# EAGLE design finalmouse (EAGLE 9.6.2)
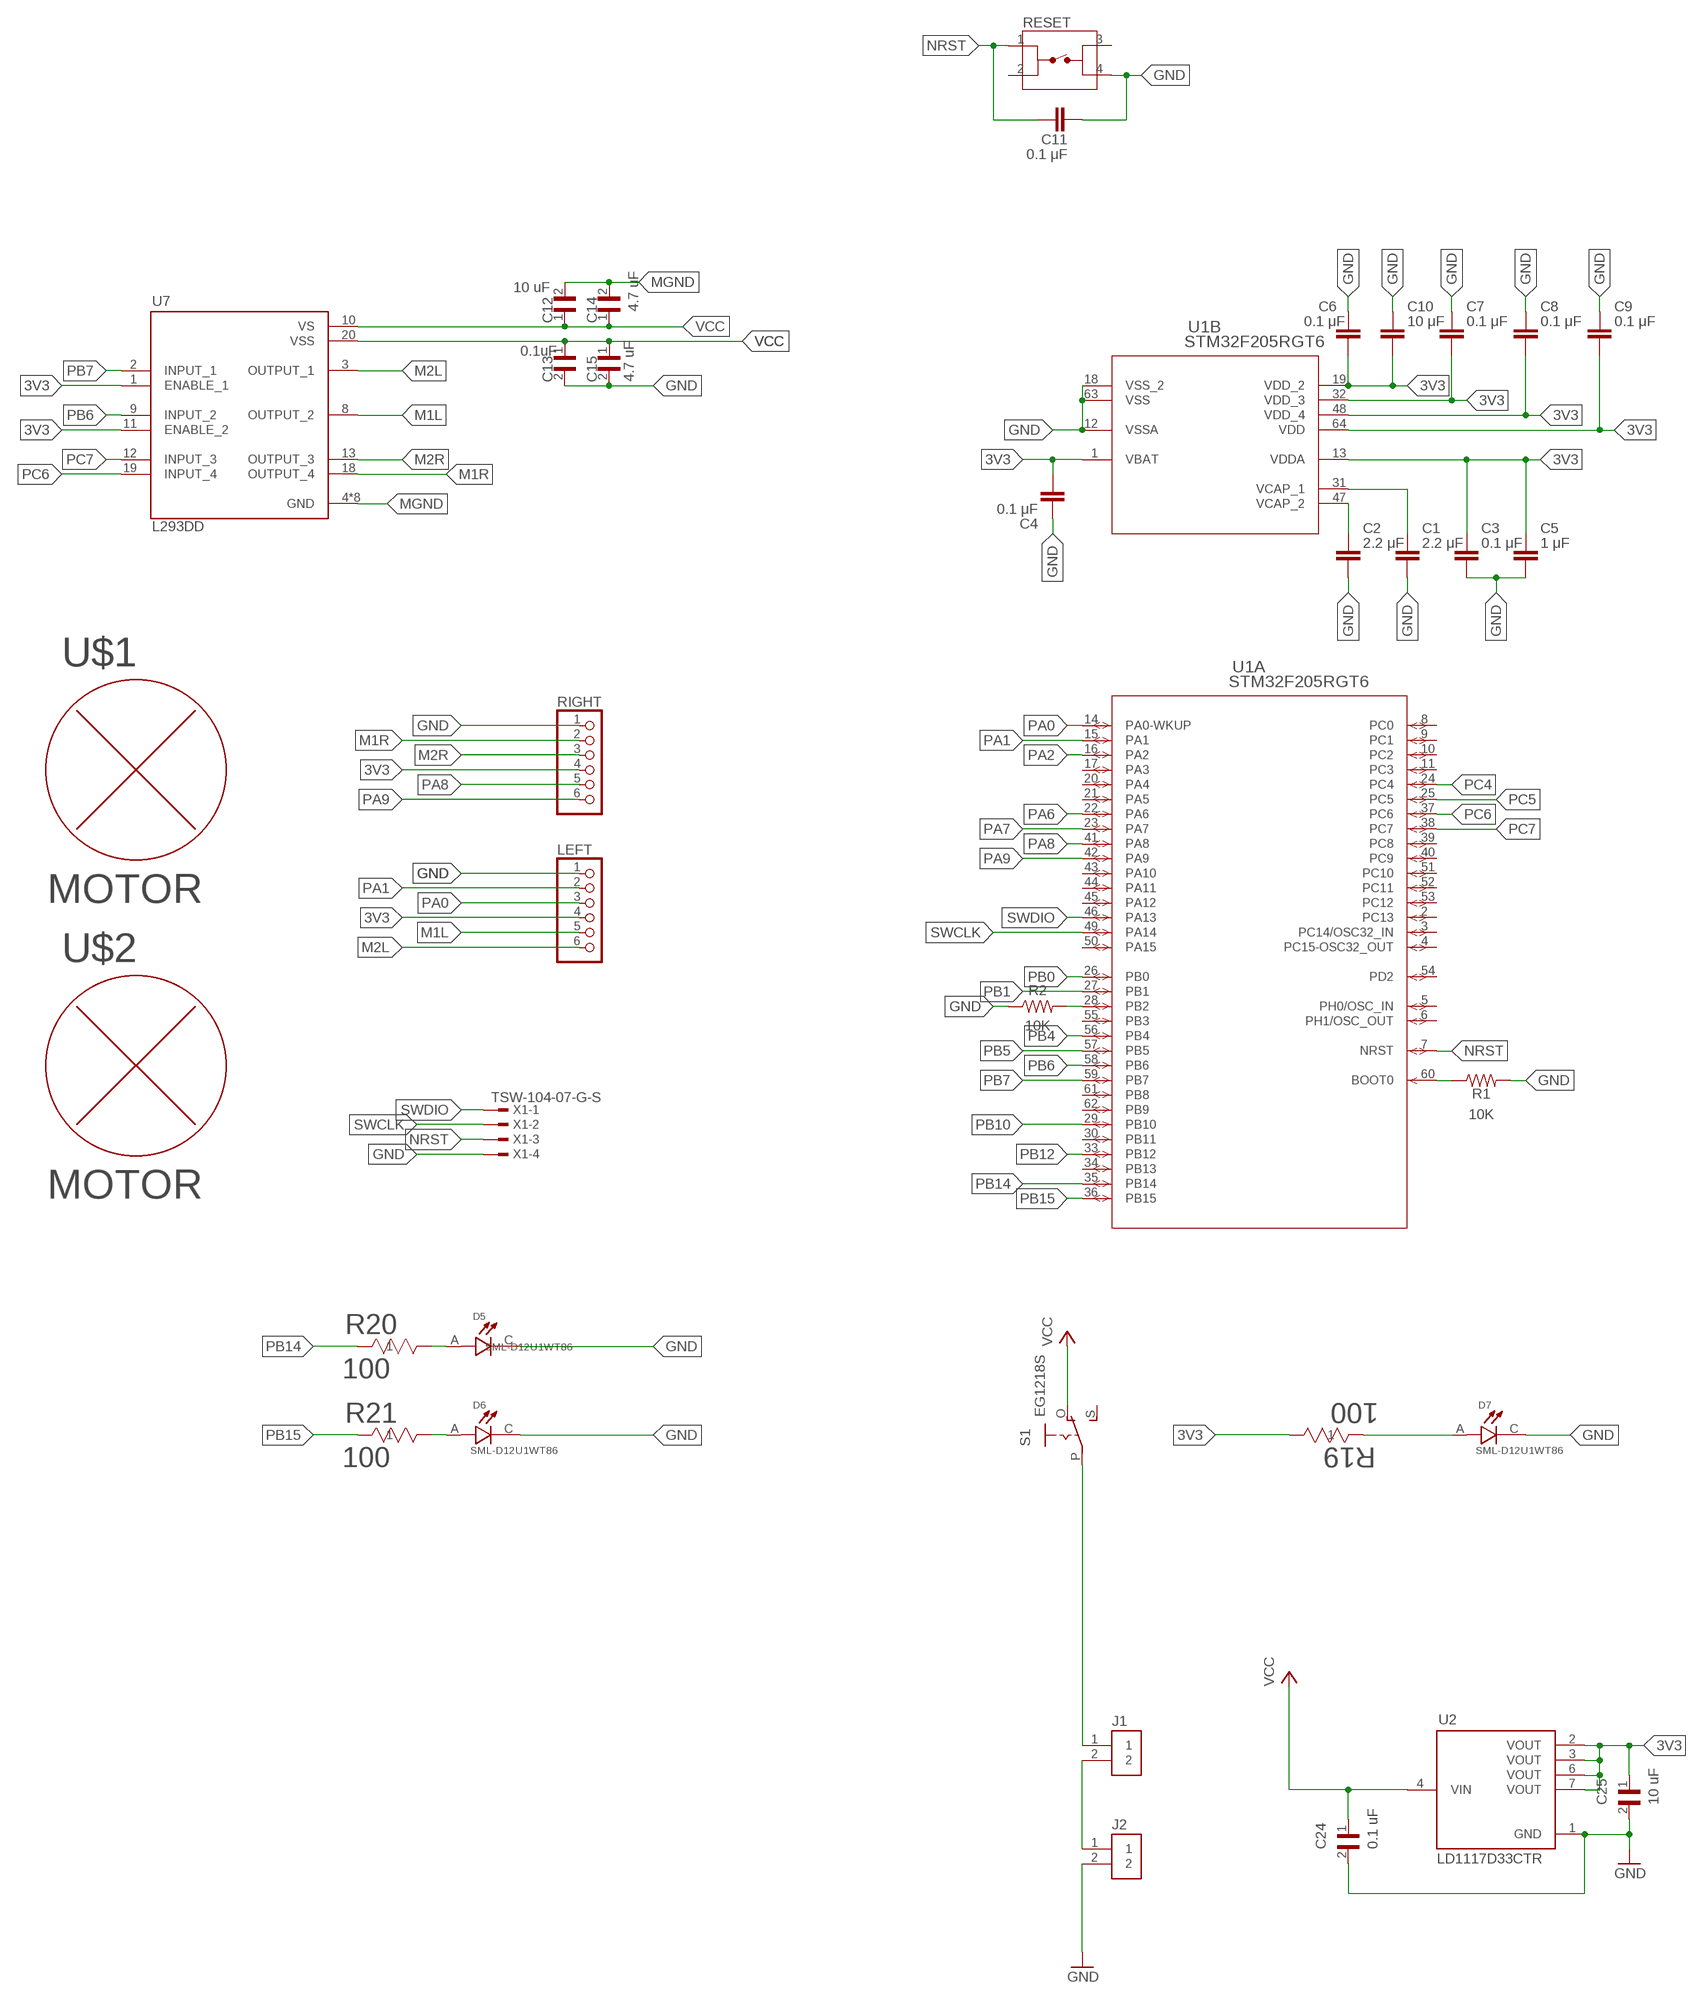
[diagram p0: schematic, sheet 1, part 1 of 2]
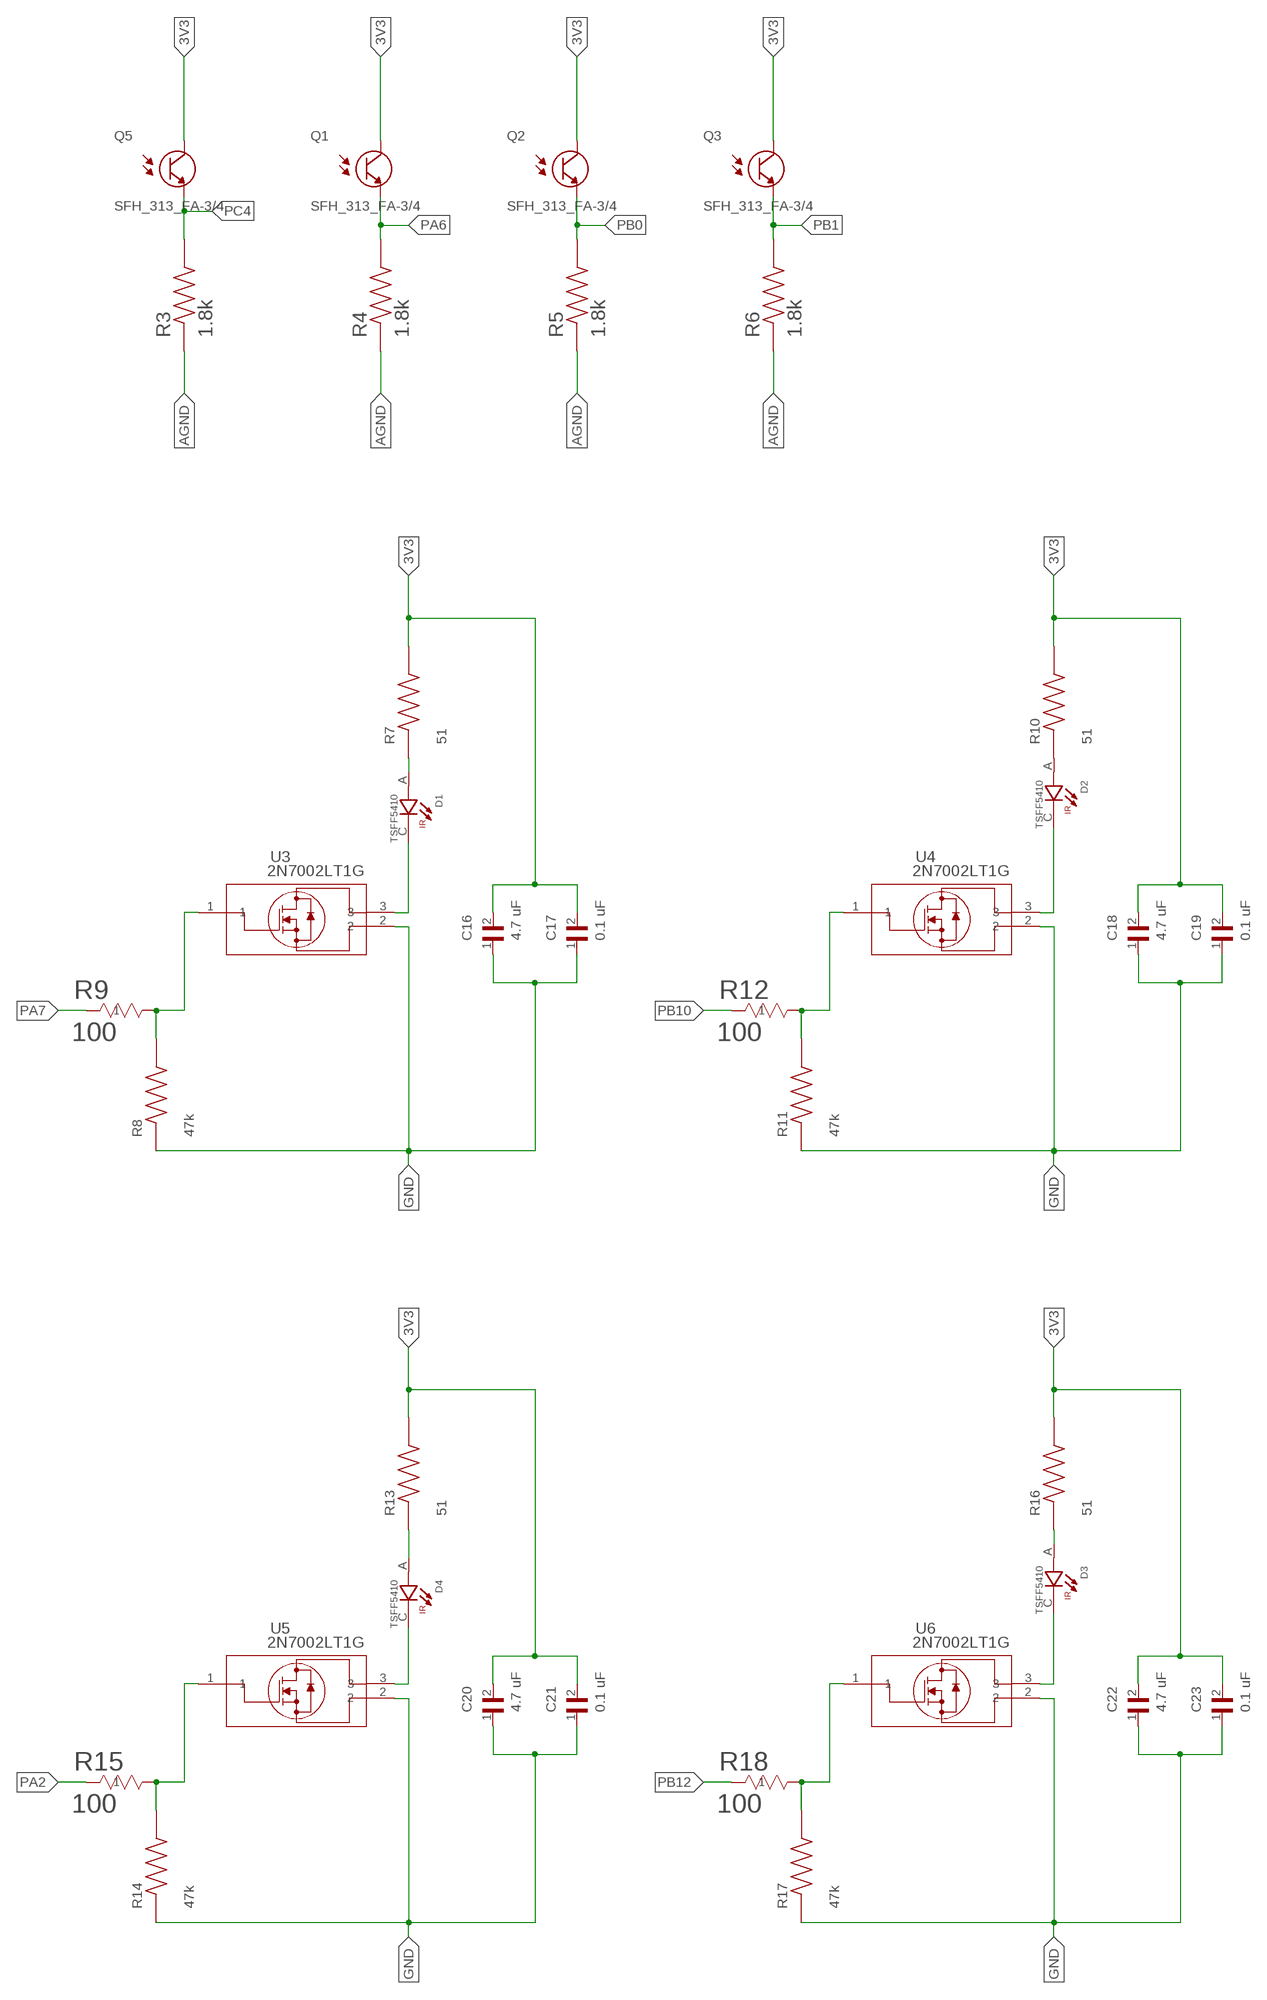
[diagram p1: schematic, sheet 1, part 2 of 2]

## Parts
C1  2.2 μF  C_CHIP-0603(1608-METRIC)  [CAPC1608X85]
C2  2.2 μF  C_CHIP-0603(1608-METRIC)  [CAPC1608X85]
C3  0.1 μF  C_CHIP-0603(1608-METRIC)  [CAPC1608X85]
C4  0.1 μF  C_CHIP-0603(1608-METRIC)  [CAPC1608X85]
C5  1 μF  C_CHIP-0603(1608-METRIC)  [CAPC1608X85]
C6  0.1 μF  C_CHIP-0603(1608-METRIC)  [CAPC1608X85]
C7  0.1 μF  C_CHIP-0603(1608-METRIC)  [CAPC1608X85]
C8  0.1 μF  C_CHIP-0603(1608-METRIC)  [CAPC1608X85]
C9  0.1 μF  C_CHIP-0603(1608-METRIC)  [CAPC1608X85]
C10  10 μF  C_CHIP-0603(1608-METRIC)  [CAPC1608X85]
C11  0.1 μF  C_CHIP-0603(1608-METRIC)  [CAPC1608X85]
C12  10 uF  CL21A106KPFNNNG  [CAPC2012X135N]
C13  0.1uF  08055C104K4T2A  [CAPC2012X94N]
C14  4.7 uF  C2012JB1C475K125AC  [CAPC2012X145N]
C15  4.7 uF  C2012JB1C475K125AC  [CAPC2012X145N]
C16  4.7 uF  C2012JB1C475K125AC  [CAPC2012X145N]
C17  0.1 uF  08055C104K4T2A  [CAPC2012X94N]
C18  4.7 uF  C2012JB1C475K125AC  [CAPC2012X145N]
C19  0.1 uF  08055C104K4T2A  [CAPC2012X94N]
C20  4.7 uF  C2012JB1C475K125AC  [CAPC2012X145N]
C21  0.1 uF  08055C104K4T2A  [CAPC2012X94N]
C22  4.7 uF  C2012JB1C475K125AC  [CAPC2012X145N]
C23  0.1 uF  08055C104K4T2A  [CAPC2012X94N]
C24  0.1 uF  CL21A106KPFNNNG  [CAPC2012X135N]
C25  10 uF  CL21A226MOQNNNE  [CAPC2012X135N]
D1  TSFF5410  [LEDRD254W55D595H1160]
D2  TSFF5410  [LEDRD254W55D595H1160]
D3  TSFF5410  [LEDRD254W55D595H1160]
D4  TSFF5410  [LEDRD254W55D595H1160]
D5  SML-D12U1WT86  [LED_SML-D12Y1WT86]
D6  SML-D12U1WT86  [LED_SML-D12Y1WT86]
D7  SML-D12U1WT86  [LED_SML-D12Y1WT86]
J1  B2B-PH-K-S(LF)(SN)  [JST_B2B-PH-K-S(LF)(SN)]
J2  B2B-PH-K-S(LF)(SN)  [JST_B2B-PH-K-S(LF)(SN)]
LEFT  PINHD-1X6  [1X06]
Q1  SFH_313_FA-3/4  [XDCR_SFH_313_FA-3/4]
Q2  SFH_313_FA-3/4  [XDCR_SFH_313_FA-3/4]
Q3  SFH_313_FA-3/4  [XDCR_SFH_313_FA-3/4]
Q5  SFH_313_FA-3/4  [XDCR_SFH_313_FA-3/4]
R1  10K  R-US_CHIP-0603(1608-METRIC)  [RESC1608X60]
R2  10K  R-US_CHIP-0603(1608-METRIC)  [RESC1608X60]
R3  1.8k  ESR10EZPJ182  [RESC2012X65N]
R4  1.8k  ESR10EZPJ182  [RESC2012X65N]
R5  1.8k  ESR10EZPJ182  [RESC2012X65N]
R6  1.8k  ESR10EZPJ182  [RESC2012X65N]
R7  51  ERJP06J510V  [RES_ERJP06J510V]
R8  47k  ERA6ARB473V  [RES_ERA6ARB473V]
R9  100  RK73G2ATTD1000D  [RES_RK73G2A_KOA]
R10  51  ERJP06J510V  [RES_ERJP06J510V]
R11  47k  ERA6ARB473V  [RES_ERA6ARB473V]
R12  100  RK73G2ATTD1000D  [RES_RK73G2A_KOA]
R13  51  ERJP06J510V  [RES_ERJP06J510V]
R14  47k  ERA6ARB473V  [RES_ERA6ARB473V]
R15  100  RK73G2ATTD1000D  [RES_RK73G2A_KOA]
R16  51  ERJP06J510V  [RES_ERJP06J510V]
R17  47k  ERA6ARB473V  [RES_ERA6ARB473V]
R18  100  RK73G2ATTD1000D  [RES_RK73G2A_KOA]
R19  100  RK73G2ATTD1000D  [RES_RK73G2A_KOA]
R20  100  RK73G2ATTD1000D  [RES_RK73G2A_KOA]
R21  100  RK73G2ATTD1000D  [RES_RK73G2A_KOA]
RESET  FSM4JSMA  [TE_FSM4JSMA]
RIGHT  PINHD-1X6  [1X06]
S1  EG1218S  [EG1218]
U1  STM32F205RGT6  [LQFP64-10X10MM]
U2  LD1117D33CTR  [SOIC127P600X175-8N]
U3  2N7002LT1G  [SOT-23_3L_ONS]
U4  2N7002LT1G  [SOT-23_3L_ONS]
U5  2N7002LT1G  [SOT-23_3L_ONS]
U6  2N7002LT1G  [SOT-23_3L_ONS]
U7  L293DD  [SOIC127P1032X265-20N]
U$1  MOTOR  [MOTOR]
U$2  MOTOR  [MOTOR]
X1  TSW-104-07-G-S  [TSW-104-XX-G-S]

## Nets
3V3: C3.1 C4.2 C5.1 C6.2 C7.2 C8.2 C9.2 C10.2 C16.2 C17.2 C18.2 C19.2 C20.2 C21.2 C22.2 C23.2 C25.1 LEFT.4 Q1.2(C) Q2.2(C) Q3.2(C) Q5.2(C) R7.2 R10.2 R13.2 R16.2 R19.2 RIGHT.4 U1.1(B:VBAT) U1.13(B:VDDA) U1.19(B:VDD_2) U1.32(B:VDD_3) U1.48(B:VDD_4) U1.64(B:VDD) U2.2(VOUT) U2.3(VOUT) U2.6(VOUT) U2.7(VOUT) U7.1(ENABLE_1) U7.11(ENABLE_2)
AGND: R3.1 R4.1 R5.1 R6.1
GND: C1.2 C2.2 C3.2 C4.1 C5.2 C6.1 C7.1 C8.1 C9.1 C10.1 C11.2 C13.2 C15.2 C16.1 C17.1 C18.1 C19.1 C20.1 C21.1 C22.1 C23.1 C24.2 C25.2 D5.C D6.C D7.C J2.2 LEFT.1 R1.2 R2.1 R8.1 R11.1 R14.1 R17.1 RESET.4 RIGHT.1 U1.12(B:VSSA) U1.18(B:VSS_2) U1.63(B:VSS) U2.1(GND) U3.2 U4.2 U5.2 U6.2 X1.4
M1L: LEFT.5 U7.8(OUTPUT_2)
M1R: RIGHT.2 U7.18(OUTPUT_4)
M2L: LEFT.6 U7.3(OUTPUT_1)
M2R: RIGHT.3 U7.13(OUTPUT_3)
MGND: C12.2 C14.2 U7.4(GND) U7.5(GND) U7.6(GND) U7.7(GND) U7.14(GND) U7.15(GND) U7.16(GND) U7.17(GND)
N$1: C1.1 U1.31(B:VCAP_1)
N$2: C2.1 U1.47(B:VCAP_2)
N$3: R1.1 U1.60(A:BOOT0)
N$4: R2.2 U1.28(A:PB2)
N$5: J1.1 S1.P
N$6: D1.A R7.1
N$7: R8.2 R9.2 U3.1
N$8: D1.C U3.3
N$9: D2.A R10.1
N$10: R11.2 R12.2 U4.1
N$11: D2.C U4.3
N$12: D3.A R16.1
N$13: R14.2 R15.2 U5.1
N$14: D4.C U5.3
N$15: D4.A R13.1
N$16: R17.2 R18.2 U6.1
N$17: D3.C U6.3
N$18: D7.A R19.1
N$19: J1.2 J2.1
N$21: D5.A R20.2
N$23: D6.A R21.2
NRST: C11.1 RESET.1 U1.7(A:NRST) X1.3
PA0: LEFT.3 U1.14(A:PA0-WKUP)
PA1: LEFT.2 U1.15(A:PA1)
PA2: R15.1 U1.16(A:PA2)
PA6: Q1.1(E) R4.2 U1.22(A:PA6)
PA7: R9.1 U1.23(A:PA7)
PA8: RIGHT.5 U1.41(A:PA8)
PA9: RIGHT.6 U1.42(A:PA9)
PB0: Q2.1(E) R5.2 U1.26(A:PB0)
PB1: Q3.1(E) R6.2 U1.27(A:PB1)
PB4: U1.56(A:PB4)
PB5: U1.57(A:PB5)
PB6: U1.58(A:PB6) U7.9(INPUT_2)
PB7: U1.59(A:PB7) U7.2(INPUT_1)
PB10: R12.1 U1.29(A:PB10)
PB12: R18.1 U1.33(A:PB12)
PB14: R20.1 U1.35(A:PB14)
PB15: R21.1 U1.36(A:PB15)
PC4: Q5.1(E) R3.2 U1.24(A:PC4)
PC5: U1.25(A:PC5)
PC6: U1.37(A:PC6) U7.19(INPUT_4)
PC7: U1.38(A:PC7) U7.12(INPUT_3)
SWCLK: U1.49(A:PA14) X1.2
SWDIO: U1.46(A:PA13) X1.1
VCC: C12.1 C13.1 C14.1 C15.1 C24.1 S1.O U2.4(VIN) U7.10(VS) U7.20(VSS)
Unconnected: RESET.2 RESET.3 S1.S U1.2(A:PC13) U1.3(A:PC14/OSC32_IN) U1.4(A:PC15-OSC32_OUT) U1.5(A:PH0/OSC_IN) U1.6(A:PH1/OSC_OUT) U1.8(A:PC0) U1.9(A:PC1) U1.10(A:PC2) U1.11(A:PC3) U1.17(A:PA3) U1.20(A:PA4) U1.21(A:PA5) U1.30(A:PB11) U1.34(A:PB13) U1.39(A:PC8) U1.40(A:PC9) U1.43(A:PA10) U1.44(A:PA11) U1.45(A:PA12) U1.50(A:PA15) U1.51(A:PC10) U1.52(A:PC11) U1.53(A:PC12) U1.54(A:PD2) U1.55(A:PB3) U1.61(A:PB8) U1.62(A:PB9)

## Library data of the parts
C1-C6 = Capacitor:C: Capacitor - Generic; CATEGORY: Capacitor
C7-C11 = Capacitor2:C: Capacitor - Generic; CATEGORY: Capacitor
C12 C24 = CL21A106KPFNNNG:CL21A106KPFNNNG: Cap Ceramic 10uF 10V X5R 10% SMD 0805 85°C Embossed Plastic T/R; DESCRIPTION: CAP CER 10UF 10V X5R 0805; DIGI-KEY_PART_NUMBER: 1276-6456-2-ND; MF: Samsung Electro-Mechanics; MP: CL21A106KPFNNNG; PACKAGE: None; PURCHASE-URL: https://pricing.snapeda.com/search/part/CL21A106KPFNNNG/?ref=eda
C13 C17 C19 C21 C23 = 08055C104K4T2A:08055C104K4T2A: Capacitor: ceramic; MLCC; 100nF; 50V; X7R; ±10%; SMD; 0805; DESCRIPTION: 0.1 µF ±10% 50V Ceramic Capacitor X7R 0805 (2012 Metric); DIGI-KEY_PART_NUMBER: 478-5311-1-ND; MF: AVX; MP: 08055C104K4T2A; PACKAGE: 2012 AVX; PURCHASE-URL: https://pricing.snapeda.com/search/part/08055C104K4T2A/?ref=eda
C14-C16 C18 C20 C22 = C2012JB1C475K125AC:C2012JB1C475K125AC: CAP CER 4.7UF 16V JB 0805; DESCRIPTION: Cap Ceramic 4.7uF 16V JB 10% SMD 0805 85°C Blister Plastic T/R; DIGI-KEY_PART_NUMBER: 445-11450-1-ND; MF: TDK; MP: C2012JB1C475K125AC; PACKAGE: 2012 TDK; PURCHASE-URL: https://pricing.snapeda.com/search/part/C2012JB1C475K125AC/?ref=eda
C25 = CL21A226MOQNNNE:CL21A226MOQNNNE; DESCRIPTION: 22µF ±20% 16V Ceramic Capacitor X5R 0805 (2012 Metric); DIGI-KEY_PART_NUMBER: 1276-2909-2-ND; MF: Samsung Electro-Mechanics; MP: CL21A226MOQNNNE; PACKAGE: 0805 Samsung Electro-Mechanics; PURCHASE-URL: https://pricing.snapeda.com/search/part/CL21A226MOQNNNE/?ref=eda
D1-D4 = TSFF5410:TSFF5410: 875 nm 100 mA ±20° Through Hole Infrared Emitting Diode - T-1; DESCRIPTION: Infrared Emitter 870nm 700mW/sr Circular Top Mount 2-Pin T-1 3/4 Bulk; DIGI-KEY_PART_NUMBER: 751-1208-ND; MF: Vishay; MP: TSFF5410; PACKAGE: Radial Vishay Semiconductor; PURCHASE-URL: https://pricing.snapeda.com/search/part/TSFF5410/?ref=eda
D5-D7 = SML-D12U1WT86:SML-D12U1WT86: RED CHIP LED MINI-MOLD; DESCRIPTION: Red 620nm LED Indication - Discrete 2.2V 0603 (1608 Metric); DIGI-KEY_PART_NUMBER: SML-D12U1WT86CT-ND; MF: Rohm; MP: SML-D12U1WT86; PACKAGE: 0603 Rohm; PURCHASE-URL: https://pricing.snapeda.com/search/part/SML-D12U1WT86/?ref=eda
J1 J2 = B2B-PH-K-S_LF__SN_:B2B-PH-K-S(LF)(SN): PH Series 2 Position 2 mm Pitch Through Hole Top Entry Shrouded Header; DESCRIPTION: Connector Header Through Hole 2 position 0.079 (2.00mm); DIGI-KEY_PART_NUMBER: 455-1704-ND; MF: JST Sales; MP: B2B-PH-K-S(LF)(SN); PACKAGE: None
LEFT RIGHT = pinhead:PINHD-1X6: PIN HEADER
Q1-Q3 Q5 = IR_RECEIVER:SFH_313_FA-3/4: Phototransistor IR Chip Silicon 870nm 2-Pin T-1 3/4; AVAILABILITY: Unavailable; DESCRIPTION: Phototransistors 870nm Top View Radial - 2 Leads; MF: OSRAM Opto; MP: SFH 313 FA-3/4; PACKAGE: Radial-2 Osram Opto; PRICE: None
R1 R2 = Resistor2:R-US: Resistor Fixed - ANSI; CATEGORY: Resistor; SUB-CATEGORY: Fixed
R3-R6 = ESR10EZPJ182:ESR10EZPJ182: Res Thick Film 0805 1.8K Ohm 5% 0.4W ±200ppm/C Pad SMD Automotive T/R; DESCRIPTION: 1.8 kOhms ±5% 0.4W, 2/5W Chip Resistor 0805 (2012 Metric) Automotive AEC-Q200, Pulse Withstanding Thick Film; DIGI-KEY_PART_NUMBER: RHM1.8KKCT-ND; MF: Rohm; MP: ESR10EZPJ182; PACKAGE: 2012 Rohm Semiconductor; PURCHASE-URL: https://pricing.snapeda.com/search/part/ESR10EZPJ182/?ref=eda
R7 R10 R13 R16 = ERJP06J510V:ERJP06J510V; DESCRIPTION: Res Thick Film 0805 51 Ohm 5% 1/4W ±200ppm/°C Molded SMD SMD Punched Carrier T/R; DIGI-KEY_PART_NUMBER: P51ADCT-ND; MF: Panasonic; MP: ERJP06J510V; PACKAGE: 2012-2 Panasonic; PURCHASE-URL: https://pricing.snapeda.com/search/part/ERJP06J510V/?ref=eda
R8 R11 R14 R17 = ERA6ARB473V:ERA6ARB473V; DESCRIPTION: 47 kOhms ±0.1% 0.125W, 1/8W Chip Resistor 0805 (2012 Metric) Automotive AEC-Q200 Thin Film; DIGI-KEY_PART_NUMBER: P47KBRCT-ND; MF: Panasonic; MP: ERA6ARB473V; PACKAGE: 2012-2 Panasonic; PURCHASE-URL: https://pricing.snapeda.com/search/part/ERA6ARB473V/?ref=eda
R9 R12 R15 R18-R21 = 100ohm resistor:RK73G2ATTD1000D; COPYRIGHT: Copyright (C) 2022 Ultra Librarian. All rights reserved.; DIGI-KEY_PART_NUMBER_1: 2019-RK73G2ATTD1000DTR-ND; DIGI-KEY_PART_NUMBER_2: 2019-RK73G2ATTD1000DCT-ND; DIGI-KEY_PART_NUMBER_3: 2019-RK73G2ATTD1000DDKR-ND; MANUFACTURER_PART_NUMBER: RK73G2ATTD1000D; MFR_NAME: KOA Speer
RESET = FSM4JSMA:FSM4JSMA: Switch Tactile OFF (ON) SPST Round Button Gull Wing 0.05A 24VDC 2.6N SMD T/R; COMMENT: 4-1437565-1; CONFIGURATION_POLE-THROW: Single Pole - Single Throw; CONTACT_CURRENT_RATING: 50 mA; DESCRIPTION: Tactile Switch SPST-NO Top Actuated Surface Mount; DIGI-KEY_PART_NUMBER: 450-1759-2-ND; EU_ROHS_COMPLIANCE: Compliant; MF: TE Connectivity; MP: FSM4JSMA; PACKAGE: None; PURCHASE-URL: https://pricing.snapeda.com/search/part/FSM4JSMA/?ref=eda
S1 = EG1218:EG1218: SLIDING SWITCH 0.1" spacing through hole, vertical SPDT slide switch http://www.ladyada.net/library/pcb/eaglelibrary.html; DESCRIPTION: Slide Switch SPDT Through Hole; DIGI-KEY_PART_NUMBER: EG1218A-ND; MF: E-Switch; MP: EG1218; PACKAGE: None; PURCHASE-URL: https://pricing.snapeda.com/search/part/EG1218/?ref=eda
U1 = stm32f205rgt6:STM32F205RGT6; COPYRIGHT: Copyright (C) 2021 Ultra Librarian. All rights reserved.; MANUFACTURER_PART_NUMBER: STM32F205RGT6; MFR_NAME: STMicroelectronics
U2 = LD1117D33CTR:LD1117D33CTR: LD1117 Series 1300 mA Low Drop Fixed Positive Voltage Regulator - SOIC-8; DESCRIPTION: Linear Voltage Regulator IC Positive Fixed 1 Output 800mA 8-SOIC; DIGI-KEY_PART_NUMBER: 497-1230-1-ND; MF: STMicroelectronics; MP: LD1117D33CTR; PACKAGE: SOIC-8 STMicroelectronics; PURCHASE-URL: https://pricing.snapeda.com/search/part/LD1117D33CTR/?ref=eda
U3-U6 = MOSFET:2N7002LT1G; COPYRIGHT: Copyright (C) 2022 Ultra Librarian. All rights reserved.; DIGI-KEY_PART_NUMBER_1: 2156-2N7002LT1G-ND; DIGI-KEY_PART_NUMBER_2: 2N7002LT1GOSCT-ND; DIGI-KEY_PART_NUMBER_3: 2N7002LT1GOSDKR-ND; DIGI-KEY_PART_NUMBER_4: 2N7002LT1GOSTR-ND; DIGI-KEY_PART_NUMBER_5: =2N7002LT1G; MANUFACTURER_PART_NUMBER: 2N7002LT1G; MFR_NAME: onsemi
U7 = L293DD (1):L293DD: L293DD Series Push - Pull Quad Channel Driver with Diodes - SOIC-20; DESCRIPTION: Bipolar Motor Driver Parallel 20-SOIC; DIGI-KEY_PART_NUMBER: 497-2937-2-ND; MF: STMicroelectronics; MP: L293DD; PACKAGE: SOIC-20 STMicroelectronics; PURCHASE-URL: https://pricing.snapeda.com/search/part/L293DD/?ref=eda
U$1 U$2 = micromouseMotors:MOTOR
X1 = con-samtec:TSW-104-*-G-S: THROUGH-HOLE .025" SQ POST HEADER Source: Samtec TSW.pdf; MF: Samtec Inc.; MPN: TSW-104-07-G-S

## Board
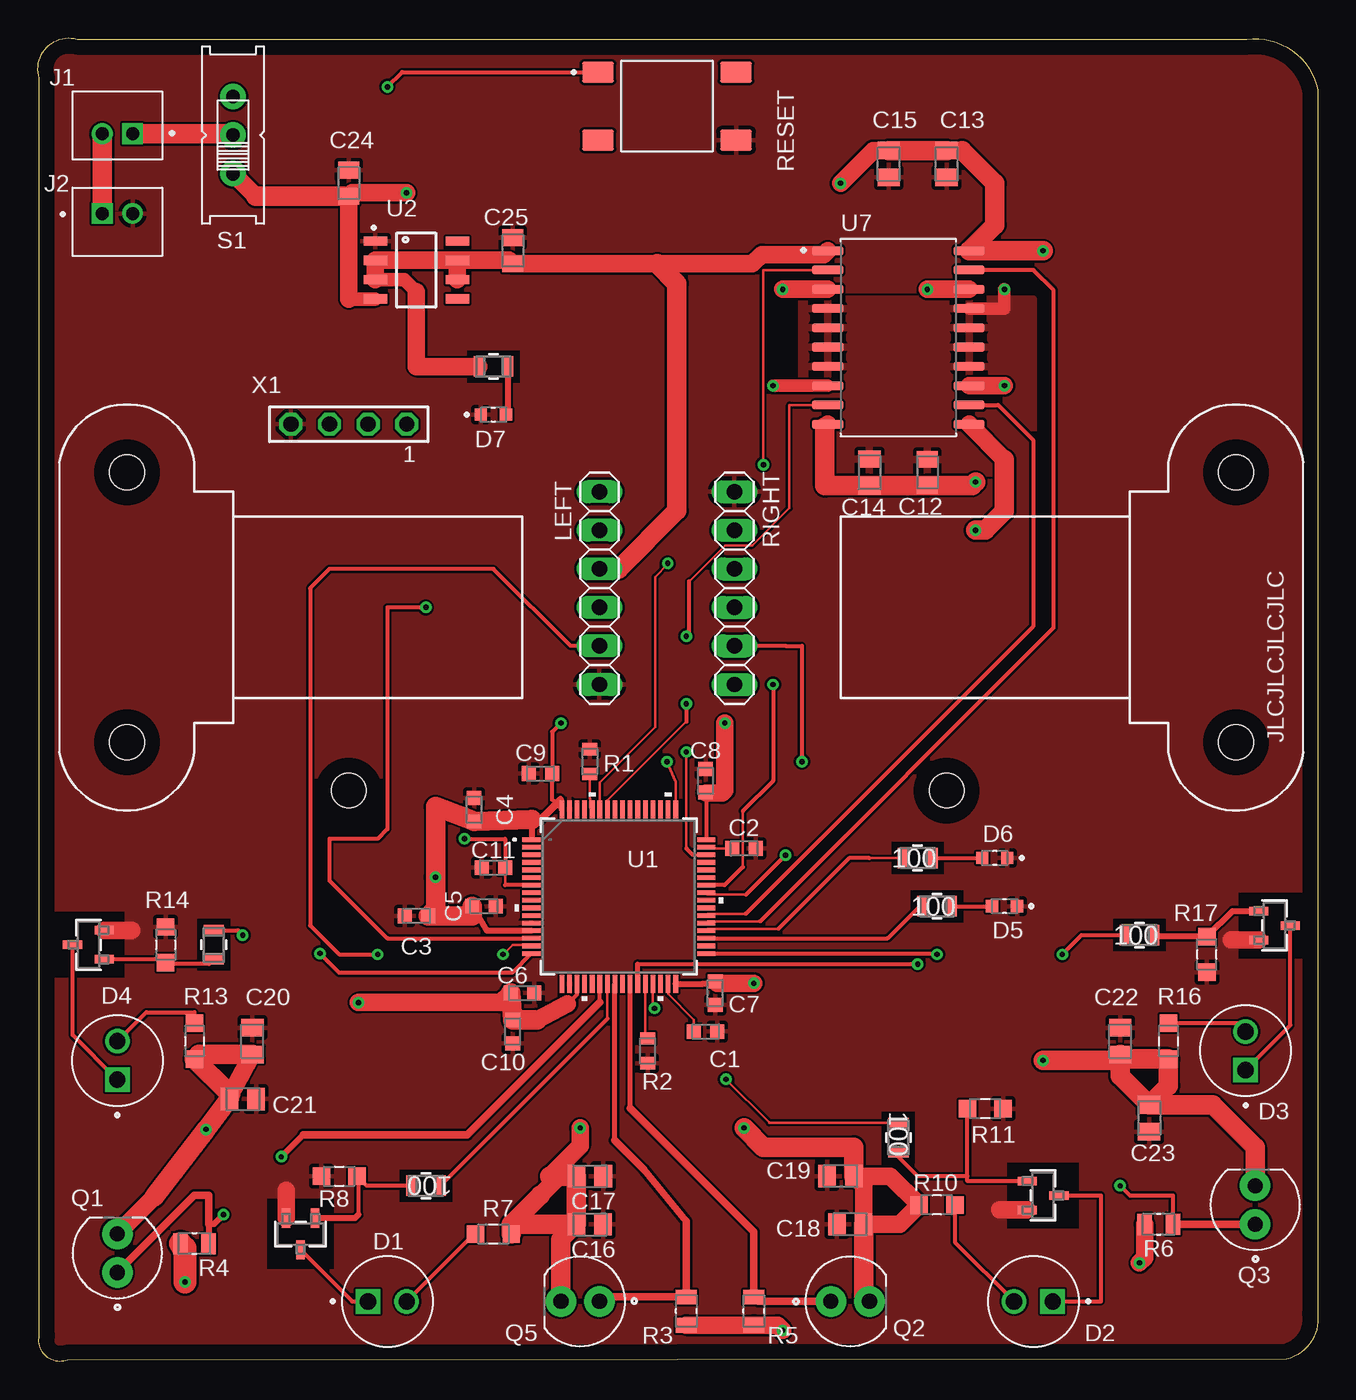
[diagram p2: board, top side]
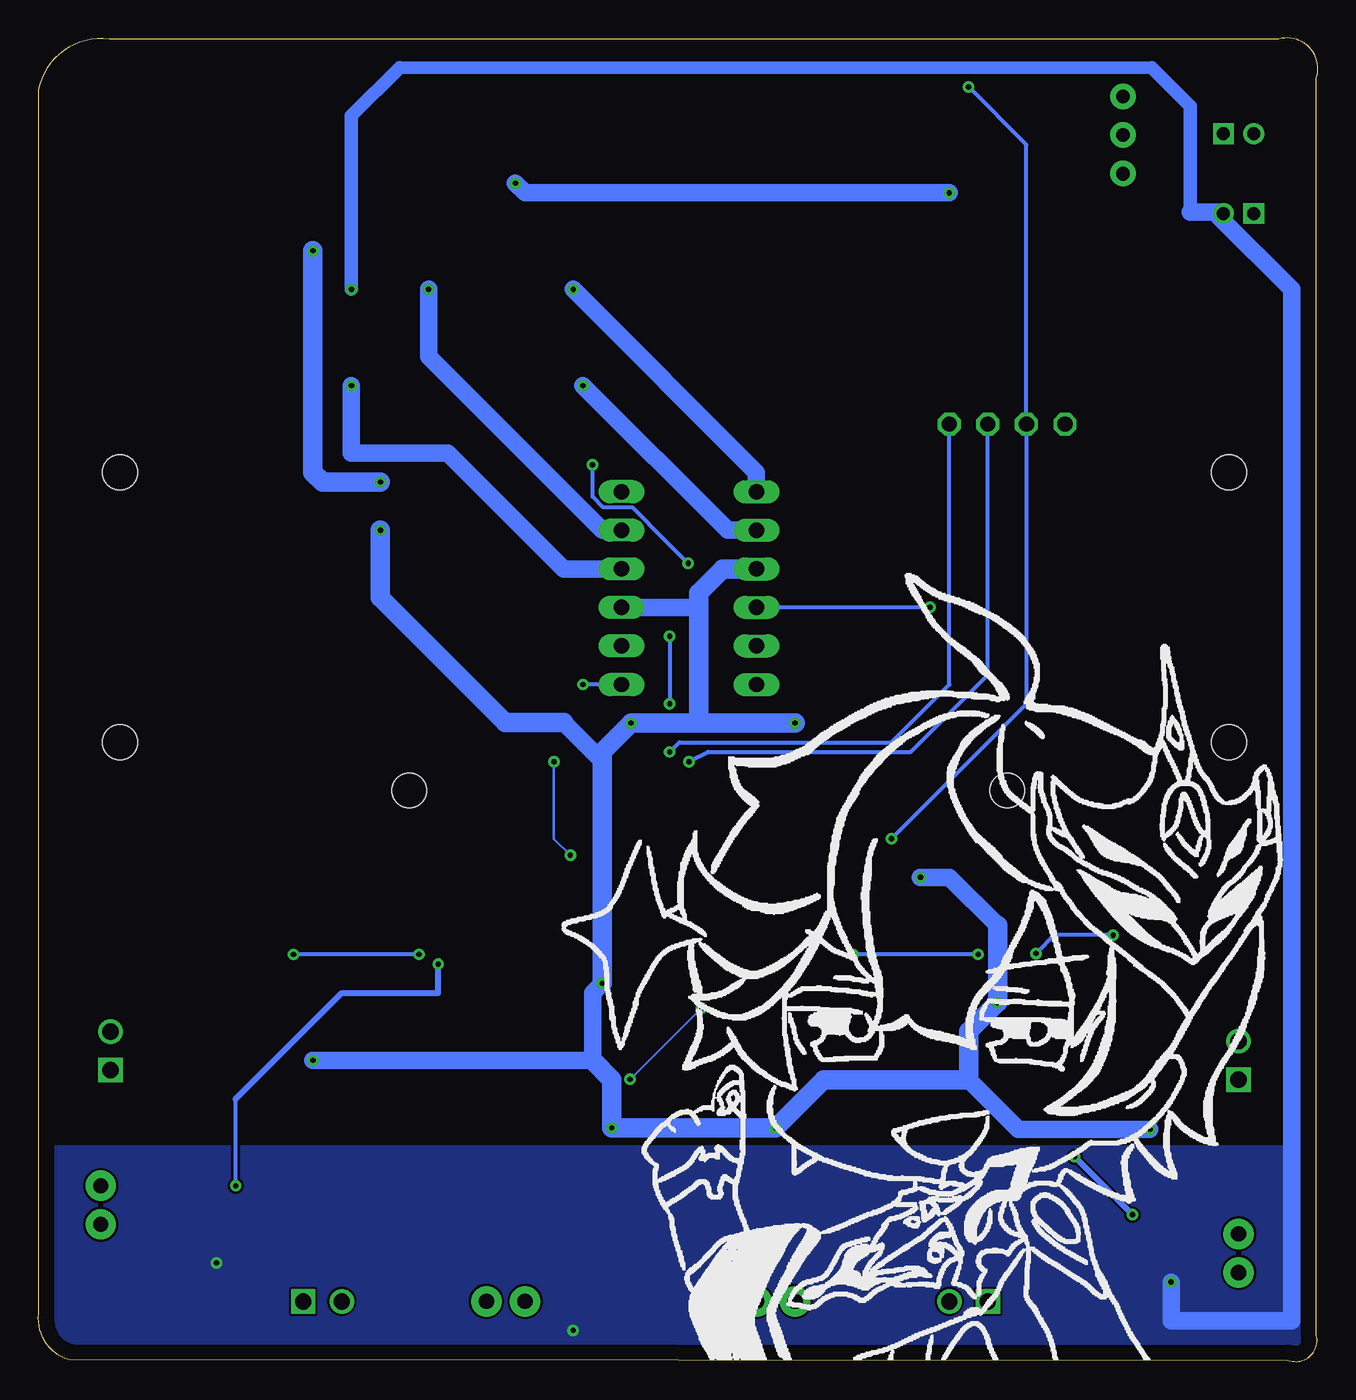
[diagram p3: board, bottom side, seen from below]

Size 84.29 x 87.19 mm. Coordinates in mm from the lower left corner, seen from the top.
Outline: 82.24,0.15 1.98,0.1 arc-126 0.1,1.73 0.1,84.53 arc-123 2.59,87.12 79.6,87.12 arc-86 84.27,83.77 84.27,3.15 arc-83 82.24,0.15
Copper layers (1*16): Top 0.035mm / dielectric 1.5mm / Bottom 0.035mm
Design rules "default": minimum track width 6mil, minimum drill 0.35mm, track to track 6mil, track to pad 6mil, pad to pad 6mil, via to via 6mil, smd to smd 6mil, copper to edge 40mil, drill to drill 6mil, minimum pad ring 10mil, minimum via ring 8mil, stop-mask expansion 4mil, vias tented up to drill 0mil, thermal gap 10mil
Holes 2.29 mm at 20.47,37.62 59.84,37.62

### Footprints (pad centres in the part's own frame; a part is rotated, then mirrored left to right if it is on the bottom)
CAPC1608X85 = smd 0.921 x 0.97: 1 -0.775,0; 2 0.775,0
CAPC2012X135N = smd 1.1 x 1.38: 1 -0.863,0; 2 0.863,0
CAPC2012X94N = smd 1.16 x 1.47: 1 -0.88,0; 2 0.88,0
CAPC2012X145N = smd 1.15 x 1.47: 1 -0.88,0; 2 0.88,0
LEDRD254W55D595H1160 = drill 1.07 pad 1.61: A 1.27,0 | drill 1.07 pad 1.61 square: C -1.27,0
LED_SML-D12Y1WT86 = smd 0.8 x 0.8: A 0.825,0; C -0.825,0
JST_B2B-PH-K-S(LF)(SN) = drill 0.86 square: 1 1,-0.55 | drill 0.86: 2 -1,-0.55
1X06 = drill 1.016 long: 1 -6.35,0; 2 -3.81,0; 3 -1.27,0; 4 1.27,0; 5 3.81,0; 6 6.35,0
XDCR_SFH_313_FA-3/4 = drill 1 pad 2: 1 -1.27,0; 2 1.27,0
RESC1608X60 = smd 0.799 x 0.974: 1 -0.815,0; 2 0.815,0
RESC2012X65N = smd 0.97 x 1.38: 1 -0.93,0; 2 0.93,0
RES_ERJP06J510V = smd 1.15 x 1.15: 1 -1.175,0; 2 1.175,0
RES_ERA6ARB473V = smd 1.15 x 1.15: 1 -1.175,0; 2 1.175,0
RES_RK73G2A_KOA = smd 0.711 x 1.346: 1 -0.953,0; 2 0.953,0
TE_FSM4JSMA = smd 2.1 x 1.38: 1 -4.55,2.24; 2 4.55,2.24; 3 -4.55,-2.24; 4 4.55,-2.24
EG1218 = drill 0.9 pad 1.676: O -2.54,0; P 0,0; S 2.54,0
LQFP64-10X10MM = smd 1.194 x 0.305: 1 -5.75,3.75; 2 -5.75,3.25; 3 -5.75,2.75; 4 -5.75,2.25; 5 -5.75,1.75; 6 -5.75,1.25; 7 -5.75,0.75; 8 -5.75,0.25; 9 -5.75,-0.25; 10 -5.75,-0.75; 11 -5.75,-1.25; 12 -5.75,-1.75; 13 -5.75,-2.25; 14 -5.75,-2.75; 15 -5.75,-3.25; 16 -5.75,-3.75; 33 5.75,-3.75; 34 5.75,-3.25; 35 5.75,-2.75; 36 5.75,-2.25; 37 5.75,-1.75; 38 5.75,-1.25; 39 5.75,-0.75; 40 5.75,-0.25; 41 5.75,0.25; 42 5.75,0.75; 43 5.75,1.25; 44 5.75,1.75; 45 5.75,2.25; 46 5.75,2.75; 47 5.75,3.25; 48 5.75,3.75 | smd 0.305 x 1.194: 17 -3.75,-5.75; 18 -3.25,-5.75; 19 -2.75,-5.75; 20 -2.25,-5.75; 21 -1.75,-5.75; 22 -1.25,-5.75; 23 -0.75,-5.75; 24 -0.25,-5.75; 25 0.25,-5.75; 26 0.75,-5.75; 27 1.25,-5.75; 28 1.75,-5.75; 29 2.25,-5.75; 30 2.75,-5.75; 31 3.25,-5.75; 32 3.75,-5.75; 49 3.75,5.75; 50 3.25,5.75; 51 2.75,5.75; 52 2.25,5.75; 53 1.75,5.75; 54 1.25,5.75; 55 0.75,5.75; 56 0.25,5.75; 57 -0.25,5.75; 58 -0.75,5.75; 59 -1.25,5.75; 60 -1.75,5.75; 61 -2.25,5.75; 62 -2.75,5.75; 63 -3.25,5.75; 64 -3.75,5.75
SOIC127P600X175-8N = smd 1.55 x 0.6: 1 -2.7,1.905; 2 -2.7,0.635; 3 -2.7,-0.635; 4 -2.7,-1.905; 5 2.7,-1.905; 6 2.7,-0.635; 7 2.7,0.635; 8 2.7,1.905
SOT-23_3L_ONS = smd 0.559 x 1.27: 1 -0.953,-1.041; 2 0.953,-1.041; 3 0,1.041
SOIC127P1032X265-20N = smd 2.05 x 0.6: 1 -4.655,5.715; 2 -4.655,4.445; 3 -4.655,3.175; 4 -4.655,1.905; 5 -4.655,0.635; 6 -4.655,-0.635; 7 -4.655,-1.905; 8 -4.655,-3.175; 9 -4.655,-4.445; 10 -4.655,-5.715; 11 4.655,-5.715; 12 4.655,-4.445; 13 4.655,-3.175; 14 4.655,-1.905; 15 4.655,-0.635; 16 4.655,0.635; 17 4.655,1.905; 18 4.655,3.175; 19 4.655,4.445; 20 4.655,5.715
MOTOR = hole 2.286: -28.575,14.605; -28.575,-3.175
TSW-104-XX-G-S = drill 1 pad 1.5 octagon: 1 3.81,0; 2 1.27,0; 3 -1.27,0; 4 -3.81,0

### Placement (x,y rotation side)
C1  43.96,21.74 0 top
C2  46.5,33.81 0 top
C3  24.91,29.36 180 top
C4  28.72,36.35 270 top
C5  29.36,30 0 top
C6  31.9,24.28 180 top
C7  44.6,24.28 90 top
C8  43.96,38.25 270 top
C9  33.09,38.73 0 top
C10  31.26,21.74 90 top
C11  29.99,32.54 180 top
C12  58.57,58.57 90 top
C13  59.84,78.89 270 top
C14  54.76,58.57 90 top
C15  56.03,78.89 270 top
C16  36.34,9.04 180 top
C17  36.34,12.22 180 top
C18  53.49,9.04 0 top
C19  52.85,12.22 0 top
C20  14.12,21.11 270 top
C21  13.48,17.3 180 top
C22  71.27,21.11 270 top
C23  73.17,16.03 90 top
C24  20.47,77.62 90 top
C25  31.26,73.18 90 top
D1  23.01,3.96 0 top
D2  65.55,3.96 180 top
D3  79.52,20.47 90 top
D4  5.23,19.84 90 top
D5  63.65,30 180 top
D6  63.01,33.17 180 top
D7  29.99,62.38 0 top
J1  5.23,81.43 0 top
J2  5.23,75.08 180 top
LEFT  36.98,50.95 90 top
Q1  5.23,7.14 90 top
Q2  53.49,3.96 0 top
Q3  80.16,10.31 90 top
Q5  35.71,3.96 180 top
R1  36.34,39.52 90 top
R2  40.15,20.47 90 top
R3  42.69,3.33 90 top
R4  10.31,7.77 0 top
R5  47.14,3.33 90 top
R6  73.81,9.04 0 top
R7  29.99,8.41 0 top
R8  19.83,12.22 0 top
R9  25.55,11.58 180 top
R10  59.2,10.31 180 top
R11  62.38,16.66 180 top
R12  56.66,14.76 270 top
R13  10.31,21.11 270 top
R14  8.4,27.46 270 top
R15  11.58,27.46 270 top
R16  74.44,21.11 270 top
R17  76.98,26.82 90 top
R18  72.54,28.09 0 top
R19  29.99,65.56 180 top
R20  59.2,30 0 top
R21  57.93,33.17 0 top
RESET  41.42,82.7 0 top
RIGHT  45.87,50.95 270 top
S1  12.85,80.8 90 top
U1  38.25,30.63 0 top
U2  24.91,71.91 0 top
U3  17.29,8.41 180 top
U4  66.19,10.95 270 top
U5  3.32,27.46 90 top
U6  81.43,28.73 270 top
U7  56.66,67.46 0 top
U$1  34.44,43.97 0 top
U$2  50.31,55.4 180 top
X1  20.47,61.75 0 top

### Tracks (layer width: path | path; a pad name or v marks a point on that pad's centre or on a via)
3V3  (via drill 0.35)
  Top 0.152: C8.2 44,37.44 | 35.5,24.19 U1.19 | 32.53,34.42 U1.1 | 32.53,35.71 33.12,35.71
  Top 0.254: 44,37.44 U1.48 | 35.5,24.19 34.86,23.55 | v34.44,42.06 33.87,41.49 C9.2 33.87,37.01 U1.64
  Top 0.33: 34.39,37.12 34.39,36.98 34.39,36.48 U1.64
  Top 0.381: C5.1 29.56,28.38 U1.13 | U1.32 43.79,24.88 C7.2 44.74,24.92 | 32.53,35.71 32.53,34.42
  Top 0.508: 33.12,35.71 34.39,36.98
  Top 0.889: 24.91,70.48 24.12,71.27 U2.3
  Top 1.143: 12.69,17.64 C20.2 | 10.6,20.23 R13.2 | C21.2 12.55,17.69 | 71.56,19.93 C22.2 70.88,19.84 | 7.67,10.85 Q1.2 | C16.2 34.44,8.02 | 34.86,23.55 32.87,22.52 | LEFT.4 38.25,52.22 | U2.3 U2.2 U2.7 | U2.7 U2.6 | U7.1 51.76,72.93 47.66,72.93 47.05,72.31 40.79,72.31 C25.1 31.03,72.54 U2.7 | 63.65,59.42 U7.11 | 24.91,70.48 24.91,65.56 R19.2 | v35.71,15.39 35.71,14.22 33.71,12.22 | 34.34,12.22 33.07,10.95 | v45.23,42.06 45.23,37.62 45.06,37.44 44,37.44 | v47.14,24.92 44.74,24.92 | C6.2 30.49,23.65 v21.1,23.65 | R10.2 56.12,12.22 C19.2 54.37,11.58 C18.2 56.76,9.04 R10.2
  Top 1.27: 33.71,12.22 34.34,12.22 C17.2 C16.2 31.17,9.04 | 33.07,10.95 31.17,9.04 | 31.17,9.04 R7.2 | C18.2 54.37,4.35 Q2.2 | 12.69,17.64 C21.2 v11.07,15.29 7.67,10.85 | C20.2 10.6,20.23 | 12.55,17.69 R13.2 | C23.2 74.44,18.18 R16.2 71.56,19.93 | C22.2 71.27,18.81 C23.2 | C23.2 77.37,16.91 80.16,14.12 Q3.2 | C6.2 C10.2 32.87,22.52 | C5.1 28.58,29.36 C3.1 26.18,29.86 v26.18,31.9 26.18,36.55 28.69,35.6 C4.2 32.53,35.71 | 34.44,8.02 Q5.2 | 38.25,52.22 42.08,56.05 42.08,71.02 40.79,72.31 | v61.74,54.76 62.38,54.76 63.65,56.03 63.65,59.42 | v66.19,19.84 70.88,19.84 | v46.5,15.39 47.77,14.12 53.73,14.12 C19.2
  Bottom 1.143: 47.14,39.55 49.68,42.09 | v66.19,19.84 47.77,19.84 47.77,24.28 v47.14,24.92 | 40.79,49.68 RIGHT.4 | 23.01,18.57 19.73,15.29 v11.07,15.29 | v26.18,31.9 24.28,31.9 21.1,28.73
  Bottom 1.27: 49.68,42.09 53.52,42.09 61.74,50.32 v61.74,54.76 | LEFT.4 39.21,52.22 40.79,50.64 40.79,49.68 40.79,42.06 | 40.79,42.06 v45.23,42.06 47.14,40.16 47.14,39.55 v47.14,24.92 | 21.1,28.73 v21.1,23.65 23.01,21.74 23.01,18.57 32.53,18.57 v35.71,15.39 v46.5,15.39 46.5,18.57 47.77,19.84 | 40.79,42.06 v34.44,42.06
AGND  (via drill 0.35)
  Top 1.143: R6.1 72.88,6.84 v72.54,6.5 | R3.1 R5.1 48.7,2.4 v49.04,2.06
  Top 1.524: R4.1 9.67,7.48 v9.67,5.23
  Bottom 1.143: v9.67,5.23 9.67,2.69 1.73,2.69 1.73,70.64 6.5,75.4 6.5,75.72
  pour Bottom: 0.78,14.12 83.33,14.12 83.33,1.42 82.06,0.15 2.05,0.15 0.78,1.42
GND
  Top 1.143: U5.2 6.18,28.41 | U3.2 16.34,11.26 | U4.2 63.33,9.99 | U6.2 78.57,27.77
  pour Top (rank 2): 0.15,87.15 83.97,87.15 83.97,0.79 83.33,0.15 1.42,0.15 0.15,1.42
M1L  (via drill 0.35)
  Top 0.813: v48.41,64.29 U7.8
  Bottom 1.143: v48.41,64.29 38.88,54.76 LEFT.5
M1R  (via drill 0.35)
  Top 1.143: v58.57,70.64 U7.18
  Bottom 1.143: RIGHT.2 47.14,54.76 58.57,66.19 v58.57,70.64
M2L  (via drill 0.35)
  Top 1.143: v49.04,70.64 U7.3
  Bottom 1.143: LEFT.6 36.98,58.57 v49.04,70.64
M2R  (via drill 0.35)
  Top 1.143: U7.13 v63.65,64.29
  Bottom 1.143: RIGHT.3 49.68,52.22 57.3,59.84 63.65,59.84 v63.65,64.29
MGND  (via drill 0.35)
  Top 0.813: U7.17 63.65,69.37 v63.65,70.64
  Bottom 0.813: 60.47,85.24 10.94,85.24
  Bottom 0.889: 8.4,75.72 8.4,82.7 10.94,85.24 | v63.65,70.64 63.65,82.07 60.47,85.24
  Bottom 1.143: 8.4,75.72 6.5,75.72
  pour Top: 65.55,70 50.31,70 50.31,56.67 65.55,56.67
N$1
  Top 0.152: U1.31 41.5,24.21 43.19,22.52 C1.1
N$2
  Top 0.152: C2.1 44.07,33.81 U1.47
N$3
  Top 0.152: U1.60 36.38,36.5 36.38,37.07 36.34,37.11 R1.1
N$4
  Top 0.152: R2.2 40,21.44 U1.28
N$5
  Top 1.143: 12.76,80.88 S1.P
  Top 1.27: J1.1 12.76,80.88
N$6
  Top 0.254: R7.1 28.72,8.41 D1.A
N$7
  Top 0.254: R8.2 21.64,11.58 R9.2
  Top 0.279: 21.1,9.68 21.1,12.12 R8.2
  Top 0.381: 21.1,9.68 20.87,9.45 U3.1
N$8
  Top 0.254: U3.3 20.7,3.96 D1.C
N$9
  Top 0.254: R10.1 60.38,7.87 D2.A
N$10
  Top 0.152: 56.66,13.49 R12.2
  Top 0.254: 61.2,12.22 61.2,11.9 U4.1 | 61.2,12.22 R11.2 | 61.2,12.22 57.93,12.22 56.66,13.49
N$11
  Top 0.254: U4.3 70,10.95 70,3.96 D2.C
N$12
  Top 0.254: D3.A 78.98,22.28 R16.1
N$13
  Top 0.152: 8.18,26.5 R14.2 8.5,26.19 | R15.2 11.26,26.19
  Top 0.254: 8.18,26.5 U5.1 | 11.26,26.19 8.5,26.19
N$14
  Top 0.254: D4.C 2.28,21.51 U5.3
N$15
  Top 0.254: D4.A 7.13,23.01 10.31,23.01 R13.1
N$16
  Top 0.381: U6.1 78.66,29.68 R17.2 73.59,28 R18.2
N$17
  Top 0.254: D3.C 82.47,22.15 U6.3
N$18
  Top 0.381: R19.1 30.94,62.51 D7.A
N$19
  Top 1.27: J1.2 J2.1
N$21
  Top 0.254: R20.2 D5.A
N$23
  Top 0.254: R21.2 D6.A
NRST  (via drill 0.35)
  Top 0.152: C11.1 30.77,31.38
  Top 0.254: U1.7 30.77,31.38 | v28.09,34.44 30.77,34.44 C11.1 | v23.01,83.97 23.98,84.94 RESET.1
  Bottom 0.254: v28.09,34.44 19.2,43.33 X1.3 19.2,80.16 v23.01,83.97
PA0  (via drill 0.35)
  Top 0.254: U1.14 23.01,27.88 19.2,31.69 19.2,34.44 22.37,34.44 23.01,35.08 23.01,49.68 v25.55,49.68
  Bottom 0.254: v25.55,49.68 LEFT.3
PA1  (via drill 0.35)
  Top 0.152: U1.15 32.5,27.44 31.25,27.44 v30.63,26.82
  Top 0.254: LEFT.2 35.07,47.14 29.99,52.22 19.2,52.22 17.93,50.95 17.93,28.73 19.83,26.82 v22.37,26.82
  Bottom 0.254: v22.37,26.82 v30.63,26.82
PA2  (via drill 0.35)
  Top 0.254: U1.16 31.23,25.61 19.83,25.61 v18.56,26.88 | R15.1 13.17,28.41 v13.48,28.09
  Bottom 0.254: v13.48,28.09 17.35,28.09 v18.56,26.88
PA6  (via drill 0.35)
  Top 0.254: 37,23.67 U1.22
  Top 0.381: 10.31,10.95 10.42,10.95 | 17.46,14.93 v16.02,13.49 | v12.21,9.68 11.58,9.04 11.24,9.04 R4.2
  Top 0.508: 10.42,10.95 11.24,10.95 11.24,9.04 | 17.46,14.93 28.26,14.93 37,23.67 | Q1.1 10.31,10.95
  Bottom 0.381: v16.02,13.49 v12.21,9.68
PA7
  Top 0.152: 37.5,22.58 U1.23
  Top 0.254: R9.1 37.5,22.58
PA8  (via drill 0.35)
  Top 0.152: U1.41 44.12,30.76 46.63,30.76
  Top 0.254: v49.24,33.37 46.63,30.76 | RIGHT.5 49.04,47.14 49.24,47.14 50.31,47.14 v50.31,39.52
  Bottom 0.152: v50.31,39.52 50.31,34.44 v49.24,33.37
PA9  (via drill 0.35)
  Top 0.152: 46.42,36.26 46.42,32.58
  Top 0.254: U1.42 45.22,31.38 46.42,32.58 | v48.41,44.6 48.41,38.25 46.42,36.26
  Bottom 0.254: RIGHT.6 v48.41,44.6
PB0
  Top 0.33: 39,16.69 U1.26
  Top 0.406: 47.43,3.96 R5.2
  Top 0.508: Q2.1 47.43,3.96 | R5.2 47.14,8.55 39,16.69
PB1  (via drill 0.35)
  Top 0.254: 71.9,10.95 74.74,10.95 R6.2
  Top 0.279: v71.27,11.58 71.9,10.95 | 39.5,26.19 v57.93,26.19
  Top 0.33: U1.27 39.5,26.19
  Top 0.508: Q3.1 R6.2
  Bottom 0.279: v71.27,11.58 71.27,17.3
  Bottom 0.381: 71.27,17.3 64.28,24.28 57.93,24.28 v57.93,26.19
PB6  (via drill 0.35)
  Top 0.152: U1.58 37.5,36.95 42.69,42.15 | U7.9 49.48,63.02 49.48,56.21 47.04,53.77 45.25,53.77 42.88,51.4 | 42.88,47.97 v42.69,47.78
  Top 0.254: 42.88,47.97 42.88,51.4 | v42.69,43.33 42.69,42.15
  Bottom 0.254: v42.69,47.78 v42.69,43.33
PB7  (via drill 0.35)
  Top 0.152: U1.59 37,38.15 40.64,41.79 40.64,51.69 41.47,52.53 v41.47,52.58 | v47.77,59.08 47.77,71.91 U7.2
  Bottom 0.254: v47.77,59.08 47.77,56.97 47.06,56.26 45.13,56.26 44.06,55.19 44.06,55.17 v41.47,52.58
PB10  (via drill 0.35)
  Top 0.152: R12.1 48.15,15.71 48.15,15.75 v45.31,18.59 | U1.29 40.5,23.37 v40.6,23.27
  Bottom 0.152: v40.6,23.27 45.28,18.59 v45.31,18.59
PB12  (via drill 0.35)
  Top 0.254: v67.46,26.82 68.73,28.09 R18.1
  Top 0.279: U1.33 59.14,26.88 v59.2,26.82
  Bottom 0.279: v59.2,26.82 v67.46,26.82
PB14
  Top 0.152: R20.1 58.06,30
  Top 0.254: U1.35 55.94,27.88 58.06,30
PB15
  Top 0.152: U1.36 44.12,28.5 48.75,28.5 | 54.76,33.17 54.88,33.17 R21.1
  Top 0.254: 54.76,33.17 53.42,33.17 48.75,28.5
PC4
  Top 0.33: 38,14.57 U1.24
  Top 0.406: Q5.1 37.27,4.26
  Top 0.508: 37.27,4.26 R3.2 42.69,9.24 39.9,12.67 38,14.57
PC6
  Top 0.152: U1.37 44.12,29 47.55,29
  Top 0.254: 47.55,29 66.89,48.34 66.89,70.57 65.55,71.91 U7.19
PC7
  Top 0.152: U1.38 44.12,29.5 46.59,29.5
  Top 0.254: 46.59,29.5 65.53,48.44 65.53,60.71 63.22,63.02 U7.12
SWCLK  (via drill 0.35)
  Top 0.152: U1.49 42,38.19 v41.42,39.52
  Bottom 0.254: X1.2 21.74,45.24 26.82,40.16 40.15,40.16 v41.42,39.52
SWDIO  (via drill 0.35)
  Top 0.152: 43.12,33.38 U1.46 | 42.69,33.81 v42.69,40.16
  Top 0.254: 43.12,33.38 42.69,33.81
  Bottom 0.254: X1.1 24.28,44.6 28.09,40.79 42.06,40.79 v42.69,40.16
VCC  (via drill 0.35)
  Top 0.889: 20.47,70 U2.4
  Top 1.143: 58.55,57.69 C12.1 | C13.1 60.86,79.77 | S1.O 14.35,76.76 | 51.83,61.57 U7.10 | 20.47,70 C24.1 20.7,76.99 v24.28,76.99 | C15.1 55,79.77 v52.85,77.62
  Top 1.27: 58.55,57.69 C14.1 51.83,57.69 51.83,61.57 | C13.1 C15.1 | 60.86,79.77 63.01,77.62 63.01,74.87 U7.20 v66.19,73.18 | 14.35,76.76 C24.1 | v61.74,57.94 61.51,57.71 C12.1
  Bottom 1.143: v24.28,76.99 52.22,76.99 v52.85,77.62
  Bottom 1.27: v66.19,73.18 66.19,58.57 65.55,57.94 v61.74,57.94

### Text on the board
tPlace: JLCJLCJLCJLC